# Altium schematic sheet LionIRVT-PMP40182.Control.SchDoc (part 1 of 3)
size A2; Date: Not shown in title block; ApprovedBy: Not shown in title block; CheckedBy: Not shown in title block; Author: Not shown in title block; CompanyName: Not shown in title block; Engineer: Not shown in title block; Organization: Not shown in title block; Address1: Not shown in title block; Address2: Not shown in title block; Address3: Not shown in title block; Address4: Not shown in title block; DocumentNumber: 1; Revision: Use project parameter SCH_Rev; SheetNumber: 3; SheetTotal: 3; PageSetup: Record=PageOptions|CenterHorizontal=True|CenterVertical=True|PrintScale=0.94|XCorrection=1.00|YCorrection=1.00|PrintKind=0|BorderSize=5000000|LeftOffset=0|BottomOffset=0|Orientation=2|PaperLength=1000|PaperWidth=1000|Scale=100|PaperSource=15|PrintQuality=600|MediaType=1|DitherType=10|PrintScaleMode=1|PaperKind=Letter; CurrentTime: Not shown in title block; CurrentDate: Not shown in title block; Time: Not shown in title block; DocumentFullPathAndName: Not shown in title block; DocumentName: Not shown in title block; ModifiedDate: Not shown in title block; ImagePath: Not shown in title block
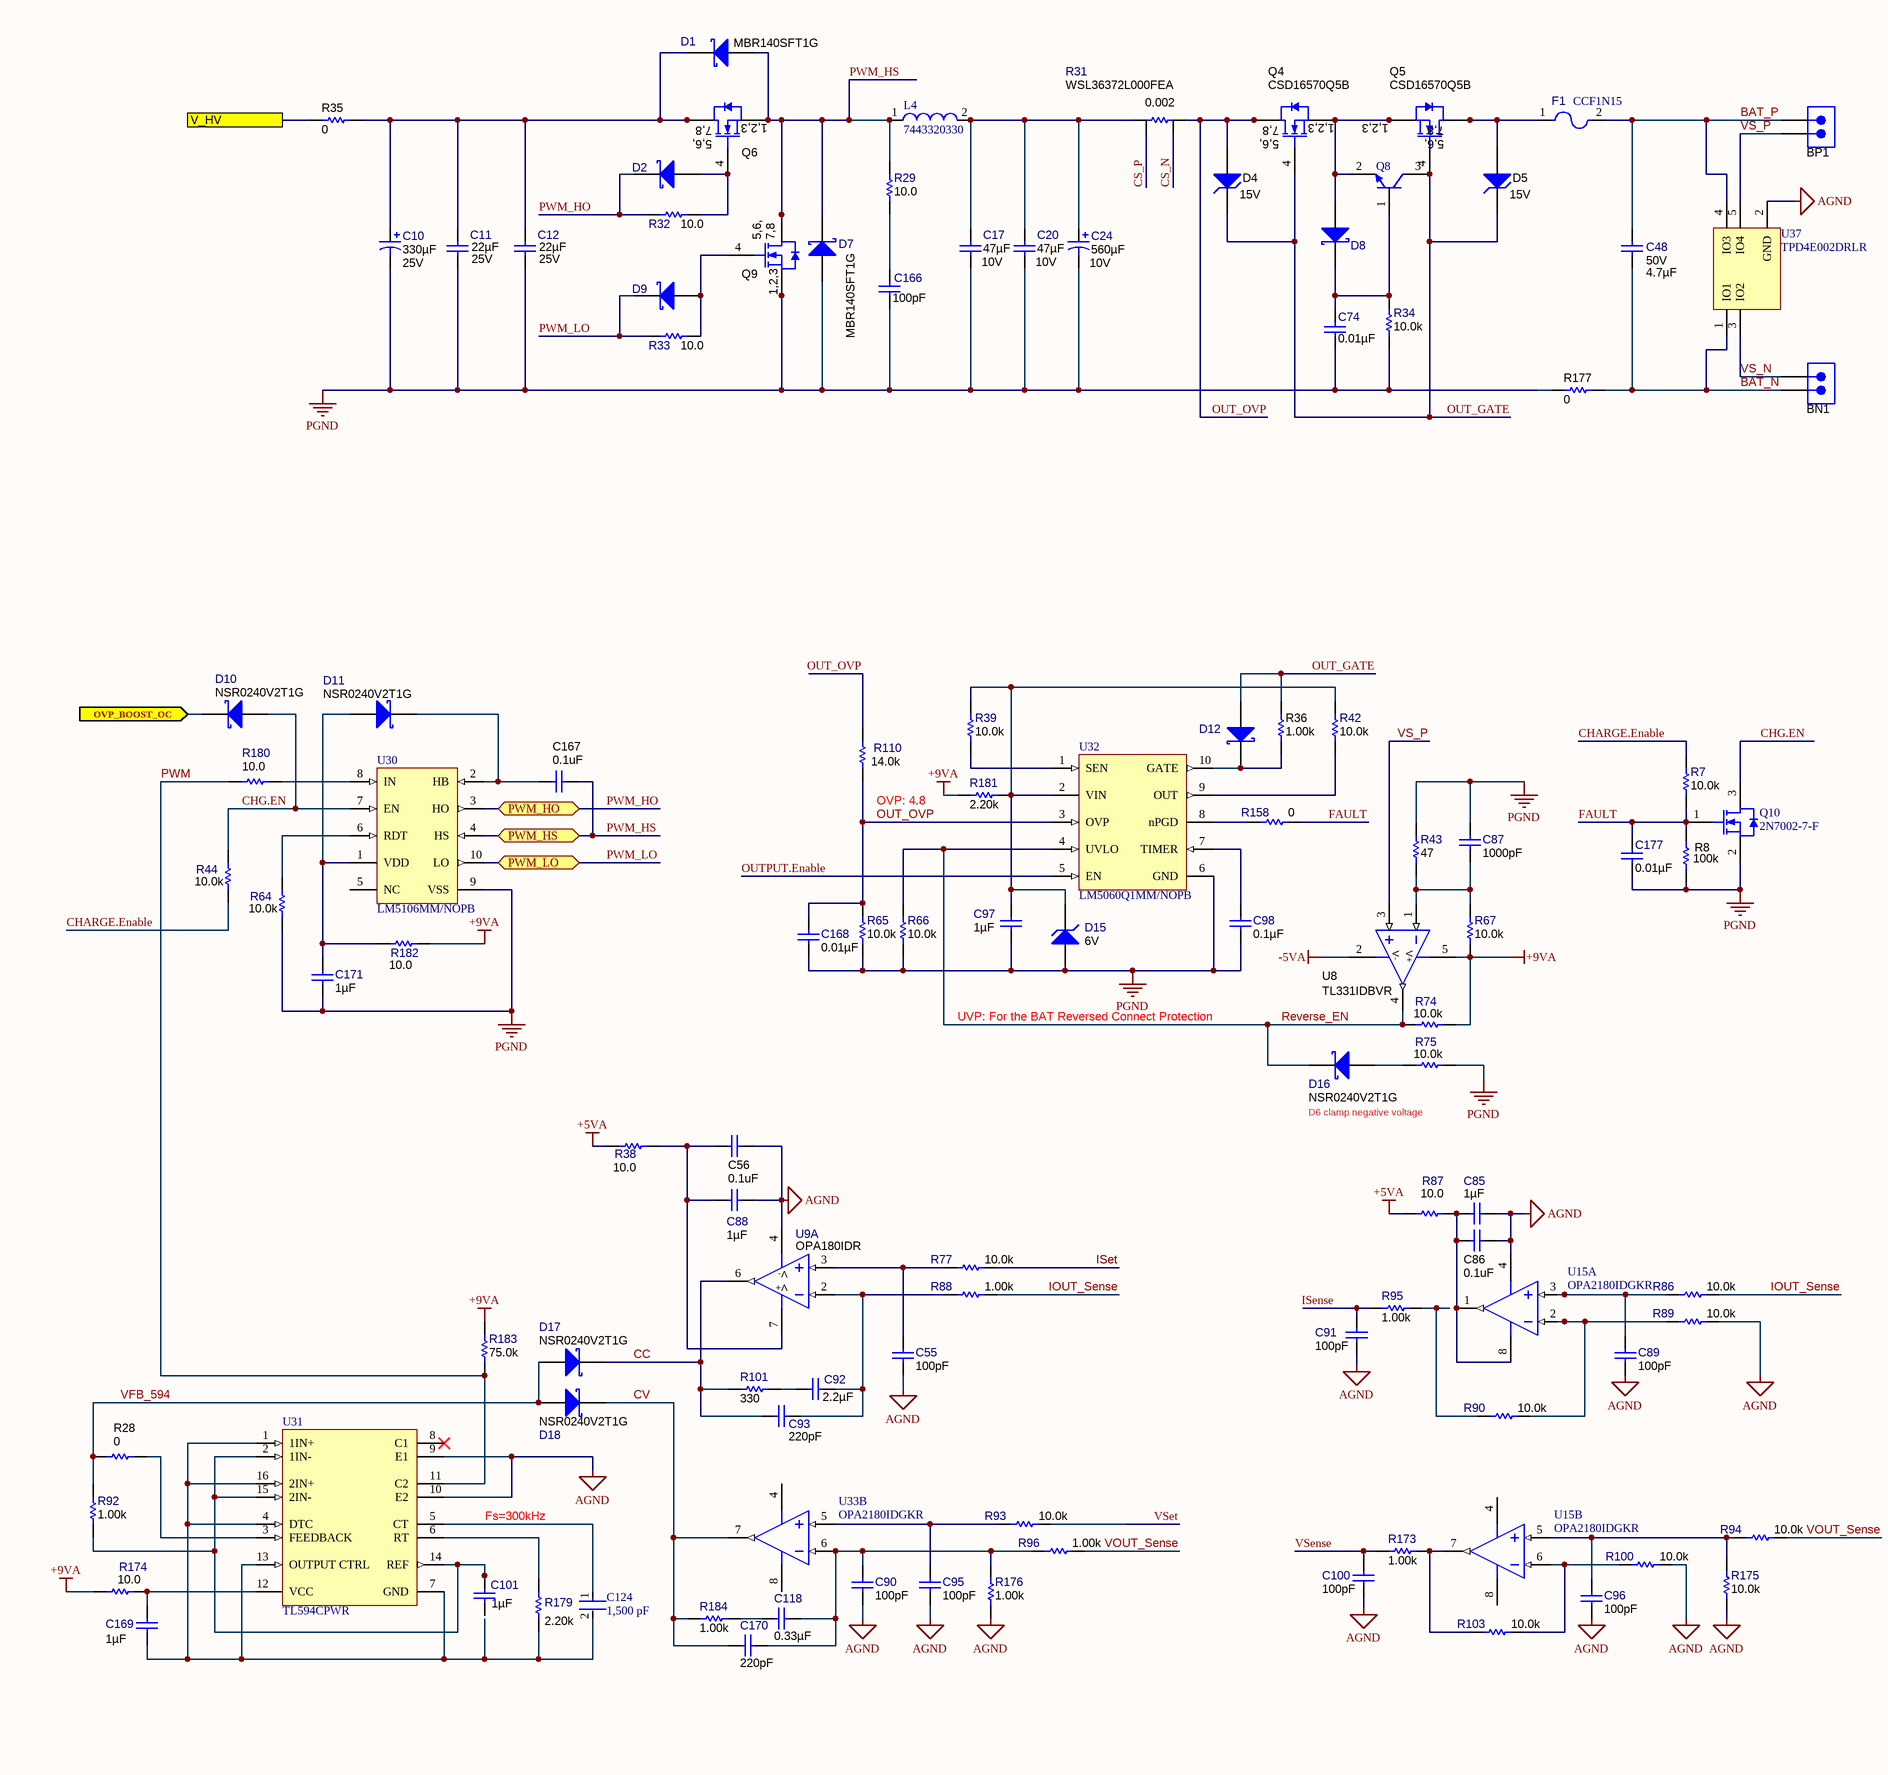
[diagram p0: LionIRVT-PMP40182.Control.SchDoc, left]
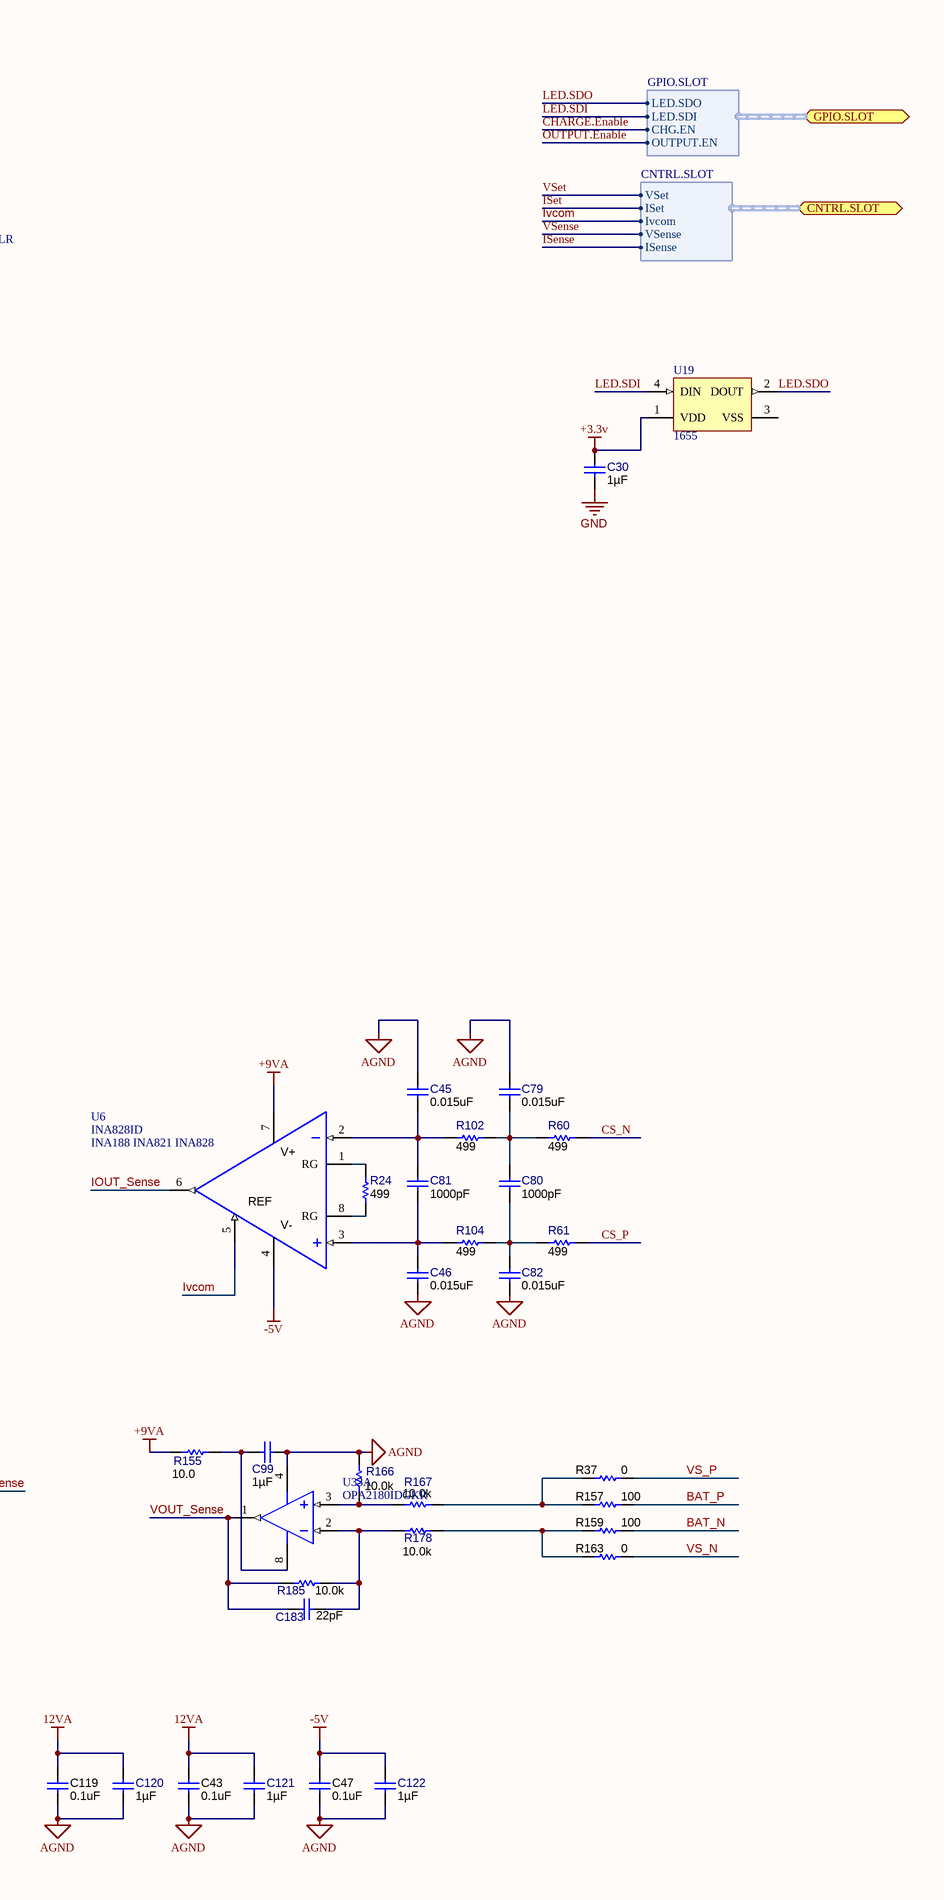
[diagram p1: LionIRVT-PMP40182.Control.SchDoc, right]

## Parts
BN1  ED555/2DS  [TERM_BLK_ED555-2DS]  (value not drawn)
BP1  ED555/2DS  [TERM_BLK_ED555-2DS]  (value not drawn)
C10  ValueDisplayed: 330µF  Value2: 25V  [CAPSMT_62_F12]  (hidden comment: 25SVPF330M)
C11  ValueDisplayed: 22µF  Value2: 25V  [1210_270]  (hidden comment: GRM32ER71E226KE15L)
C12  ValueDisplayed: 22µF  Value2: 25V  [1210_270]  (hidden comment: GRM32ER71E226KE15L)
C17  ValueDisplayed: 47µF  Value2: 10V  [1210_270]  (hidden comment: GRM32ER71A476ME15L)
C20  ValueDisplayed: 47µF  Value2: 10V  [1210_270]  (hidden comment: GRM32ER71A476ME15L)
C24  ValueDisplayed: 560µF  Value2: 10V  [SM_RADIAL_10AMM]  (hidden comment: 10SVP560M)
C30  ValueDisplayed: 1µF  [0603C]  (hidden comment: C0603C105K3RACTU)
C43  ValueDisplayed: 0.1uF  [0603C]  (hidden comment: Capacitor)
C45  ValueDisplayed: 0.015uF  [0603C]  (hidden comment: Capacitor)
C46  ValueDisplayed: 0.015uF  [0603C]  (hidden comment: Capacitor)
C47  ValueDisplayed: 0.1uF  [0603C]  (hidden comment: Capacitor)
C48  ValueDisplayed: 4.7µF  Value2: 50V  [1206L]  (hidden comment: GRM319R61H475KA12)
C55  ValueDisplayed: 100pF  [0603C]  (hidden comment: GRM1885C1H101JA01D)
C56  ValueDisplayed: 0.1uF  [0603C]  (hidden comment: Capacitor)
C74  ValueDisplayed: 0.01µF  [0603C]  (hidden comment: GRM1885C1H103JA01D)
C79  ValueDisplayed: 0.015uF  [0603C]  (hidden comment: Capacitor)
C80  ValueDisplayed: 1000pF  [0603C]  (hidden comment: Capacitor)
C81  ValueDisplayed: 1000pF  [0603C]  (hidden comment: Capacitor)
C82  ValueDisplayed: 0.015uF  [0603C]  (hidden comment: Capacitor)
C85  ValueDisplayed: 1µF  [0603C]  (hidden comment: C0603C105K3RACTU)
C86  ValueDisplayed: 0.1uF  [0603C]  (hidden comment: Capacitor)
C87  ValueDisplayed: 1000pF  [0603C]  (hidden comment: GRM1885C1H102JA01D)
C88  ValueDisplayed: 1µF  [0603C]  (hidden comment: C0603C105K3RACTU)
C89  ValueDisplayed: 100pF  [0603C]  (hidden comment: GRM1885C1H101JA01D)
C90  ValueDisplayed: 100pF  [0603C]  (hidden comment: GRM1885C1H101JA01D)
C91  ValueDisplayed: 100pF  [0603C]  (hidden comment: GRM1885C1H101JA01D)
C92  ValueDisplayed: 2.2µF  [0603C]  (hidden comment: GRM188R71A225KE15D)
C93  ValueDisplayed: 220pF  [0603C]  (hidden comment: GRM1885C1H221JA01D)
C95  ValueDisplayed: 100pF  [0603C]  (hidden comment: GRM1885C1H101JA01D)
C96  ValueDisplayed: 100pF  [0603C]  (hidden comment: GRM1885C1H101JA01D)
C97  ValueDisplayed: 1µF  [0603C]  (hidden comment: C0603C105K3RACTU)
C98  ValueDisplayed: 0.1µF  [0603C]  (hidden comment: C0603C104J3RACTU)
C99  ValueDisplayed: 1µF  [0603C]  (hidden comment: C0603C105K3RACTU)
C100  ValueDisplayed: 100pF  [0603C]  (hidden comment: GRM1885C1H101JA01D)
C101  ValueDisplayed: 1µF  [0603C]  (hidden comment: C0603C105K3RACTU)
C118  ValueDisplayed: 0.33µF  [0603C]  (hidden comment: GRM188R71A334KA61D)
C119  ValueDisplayed: 0.1uF  [0603C]  (hidden comment: Capacitor)
C120  ValueDisplayed: 1µF  [0603C]  (hidden comment: C0603C105K3RACTU)
C121  ValueDisplayed: 1µF  [0603C]  (hidden comment: C0603C105K3RACTU)
C122  ValueDisplayed: 1µF  [0603C]  (hidden comment: C0603C105K3RACTU)
C124  Capacitance: 1,500 pF  [FP-C0603C-CF-MFG]  (hidden comment: C0603C152J1GACTU)
C166  ValueDisplayed: 100pF  [0603C]  (hidden comment: GRM1885C1H101JA01D)
C167  ValueDisplayed: 0.1uF  [0603C]  (hidden comment: Capacitor)
C168  ValueDisplayed: 0.01µF  [0603C]  (hidden comment: GRM1885C1H103JA01D)
C169  ValueDisplayed: 1µF  [0603C]  (hidden comment: C0603C105K3RACTU)
C170  ValueDisplayed: 220pF  [0603C]  (hidden comment: GRM1885C1H221JA01D)
C171  ValueDisplayed: 1µF  [0603C]  (hidden comment: C0603C105K3RACTU)
C177  ValueDisplayed: 0.01µF  [0603C]  (hidden comment: GRM1885C1H103JA01D)
C183  ValueDisplayed: 22pF  [0603C]  (hidden comment: C0603C220J5GACTU)
D1  MBR140SFT1G  [SOD-123FL]
D2  NSR0240V2T1G  [SOD-523]  (value not drawn)
D4  value 15V  [sod-323]  (hidden comment: MMSZ5245BS-7-F)
D5  value 15V  [sod-323]  (hidden comment: MMSZ5245BS-7-F)
D7  MBR140SFT1G  [SOD-123FL]
D8  NSR0240V2T1G  [SOD-523]  (value not drawn)
D9  NSR0240V2T1G  [SOD-523]  (value not drawn)
D10  NSR0240V2T1G  [SOD-523]
D11  NSR0240V2T1G  [SOD-523]
D12  NSR0240V2T1G  [SOD-523]  (value not drawn)
D15  6V  [sod-323]
D16  NSR0240V2T1G  [SOD-523]
D17  NSR0240V2T1G  [SOD-523]
D18  NSR0240V2T1G  [SOD-523]
F1  CCF1N15  [FUSE_CCF]
L4  7443320330  [WE-HCC-1210]
Q4  CSD16570Q5B  [DNK8]
Q5  CSD16570Q5B  [DNK8]
Q6  CSD18502Q5B  [DNK8]  (value not drawn)
Q8  MMBT2222ALT1G  [ONSC-SOT-23-3-318-08_V]  (value not drawn)
Q9  CSD18502Q5B  [DNK8]  (value not drawn)
Q10  2N7002-7-F  [DIOD-SOT23-3_V]
R7  ValueDisplayed: 10.0k  [0603R]  (hidden comment: RC0603FR-0710KL)
R8  ValueDisplayed: 100k  [0603R]  (hidden comment: Resistor)
R24  ValueDisplayed: 499  [0603R]  (hidden comment: RC0603FR-07499RL)
R28  ValueDisplayed: 0  [0603R]  (hidden comment: Resistor)
R29  ValueDisplayed: 10.0  [1206L]  (hidden comment: RC1206FR-0710RL)
R31  WSL36372L000FEA  ValueDisplayed: 0.002  [WSL3637_0.001]
R32  ValueDisplayed: 10.0  [0603R]  (hidden comment: RC0603FR-0710RL)
R33  ValueDisplayed: 10.0  [0603R]  (hidden comment: RC0603FR-0710RL)
R34  ValueDisplayed: 10.0k  [0603R]  (hidden comment: RC0603FR-0710KL)
R35  value 0  [1206]  (hidden comment: ERJ-8ENF10R0V)
R36  ValueDisplayed: 1.00k  [0603R]  (hidden comment: Resistor)
R37  ValueDisplayed: 0  [0603R]  (hidden comment: Resistor)
R38  ValueDisplayed: 10.0  [0603R]  (hidden comment: RC0603FR-0710RL)
R39  ValueDisplayed: 10.0k  [0603R]  (hidden comment: RC0603FR-0710KL)
R42  ValueDisplayed: 10.0k  [0603R]  (hidden comment: RC0603FR-0710KL)
R43  ValueDisplayed: 47  [0603R]  (hidden comment: CRCW060347R0JNEA)
R44  ValueDisplayed: 10.0k  [0603R]  (hidden comment: RC0603FR-0710KL)
R60  ValueDisplayed: 499  [0603R]  (hidden comment: Resistor)
R61  ValueDisplayed: 499  [0603R]  (hidden comment: Resistor)
R64  ValueDisplayed: 10.0k  [0603R]  (hidden comment: RC0603FR-0710KL)
R65  ValueDisplayed: 10.0k  [0603R]  (hidden comment: RC0603FR-0710KL)
R66  ValueDisplayed: 10.0k  [0603R]  (hidden comment: RC0603FR-0710KL)
R67  ValueDisplayed: 10.0k  [0603R]  (hidden comment: RC0603FR-0710KL)
R74  ValueDisplayed: 10.0k  [0603R]  (hidden comment: RC0603FR-0710KL)
R75  ValueDisplayed: 10.0k  [0603R]  (hidden comment: RC0603FR-0710KL)
R77  ValueDisplayed: 10.0k  [0603R]  (hidden comment: RC0603FR-0710KL)
R86  ValueDisplayed: 10.0k  [0603R]  (hidden comment: RC0603FR-0710KL)
R87  ValueDisplayed: 10.0  [0603R]  (hidden comment: RC0603FR-0710RL)
R88  ValueDisplayed: 1.00k  [0603R]  (hidden comment: RC0603FR-071KL)
R89  ValueDisplayed: 10.0k  [0603R]  (hidden comment: RC0603FR-0710KL)
R90  ValueDisplayed: 10.0k  [0603R]  (hidden comment: RC0603FR-0710KL)
R92  ValueDisplayed: 1.00k  [0603R]  (hidden comment: RC0603FR-071KL)
R93  ValueDisplayed: 10.0k  [0603R]  (hidden comment: RC0603FR-0710KL)
R94  ValueDisplayed: 10.0k  [0603R]  (hidden comment: RC0603FR-0710KL)
R95  ValueDisplayed: 1.00k  [0603R]  (hidden comment: RC0603FR-071KL)
R96  ValueDisplayed: 1.00k  [0603R]  (hidden comment: RC0603FR-071KL)
R100  ValueDisplayed: 10.0k  [0603R]  (hidden comment: RC0603FR-0710KL)
R101  ValueDisplayed: 330  [0603R]  (hidden comment: RC0603FR-07330RL)
R102  ValueDisplayed: 499  [0603R]  (hidden comment: CRCW0603499RFKEA)
R103  ValueDisplayed: 10.0k  [0603R]  (hidden comment: RC0603FR-0710KL)
R104  ValueDisplayed: 499  [0603R]  (hidden comment: CRCW0603499RFKEA)
R110  ValueDisplayed: 14.0k  [0603R]  (hidden comment: RC0603FR-0714KL)
R155  ValueDisplayed: 10.0  [0603R]  (hidden comment: RC0603FR-0710RL)
R157  ValueDisplayed: 100  [0603R]  (hidden comment: Resistor)
R158  ValueDisplayed: 0  [0603R]  (hidden comment: RC0603JR-070RL)
R159  ValueDisplayed: 100  [0603R]  (hidden comment: Resistor)
R163  ValueDisplayed: 0  [0603R]  (hidden comment: Resistor)
R166  ValueDisplayed: 10.0k  [0603R]  (hidden comment: RC0603FR-0710KL)
R167  ValueDisplayed: 10.0k  [0603R]  (hidden comment: RC0603FR-0710KL)
R173  ValueDisplayed: 1.00k  [0603R]  (hidden comment: RC0603FR-071KL)
R174  ValueDisplayed: 10.0  [0603R]  (hidden comment: RC0603FR-0710RL)
R175  ValueDisplayed: 10.0k  [0603R]  (hidden comment: RC0603FR-0710KL)
R176  ValueDisplayed: 1.00k  [0603R]  (hidden comment: RC0603FR-071KL)
R177  value 0  [1206]  (hidden comment: ERJ-8ENF10R0V)
R178  ValueDisplayed: 10.0k  [0603R]  (hidden comment: RC0603FR-0710KL)
R179  ValueDisplayed: 2.20k  [0603R]  (hidden comment: RC0603FR-072K2L)
R180  ValueDisplayed: 10.0  [0603R]  (hidden comment: RC0603FR-0710RL)
R181  ValueDisplayed: 2.20k  [0603R]  (hidden comment: RC0603FR-072K2L)
R182  ValueDisplayed: 10.0  [0603R]  (hidden comment: RC0603FR-0710RL)
R183  ValueDisplayed: 75.0k  [0603R]  (hidden comment: RC0603FR-0775KL)
R184  ValueDisplayed: 1.00k  [0603R]  (hidden comment: RC0603FR-071KL)
R185  ValueDisplayed: 10.0k  [0603R]  (hidden comment: RC0603FR-0710KL)
U6  INA828ID  [D0008A_N]
U8  TL331IDBVR  [DBV0005A_N]
U9  OPA180IDR  [D0008A_N]  (part A of 2)
U15  OPA2180IDGKR  [DGK0008A_N]  (parts A,B of 2)
U19  1655  [ADA-RGB-1655_V]
U30  LM5106MM/NOPB  [DGS0010A_N]
U31  TL594CPWR  [PW0016A_M]
U32  LM5060Q1MM/NOPB  [DGS0010A_N]
U33  OPA2180IDGKR  [DGK0008A_N]  (parts A,B of 2)
U37  TPD4E002DRLR  [DRL0005A_L]

## Ports
CNTRL.SLOT (bidir, harness CNTRL.SLOT), GPIO.SLOT (bidir, harness GPIO.SLOT), OVP_BOOST_OC (in), PWM_HO (bidir), PWM_HS (bidir), PWM_LO (bidir), V_HV

## Harnesses
GPIO.SLOT: LED.SDO, CHG.EN, LED.SDI, OUTPUT.EN
CNTRL.SLOT: VSet, ISet, Ivcom, VSense, ISense

## Nets
12VA: C43.1 C119.1 C120.2 C121.2
+3.3v: C30.2 U19.1(VDD)
+5VA: R38.2 R87.2
+9VA: R67.2 R74.1 R155.1 R174.1 R181.1 R182.2 R183.2 U6.7(V+) U8.5(V+)
-5V: C47.1 C122.2 U6.4(V-)
-5VA: U8.2(V-/GND)
AGND: C43.2 C45.2 C46.2 C47.2 C55.1 C56.2 C79.2 C82.2 C85.1 C86.2 C88.1 C89.1 C90.1 C91.2 C95.1 C96.1 C99.2 C100.2 C119.2 C120.1 C121.1 C122.1 R89.1 R100.1 R166.2 R175.2 R176.2 U9.4(V-) U15.4(V-) U31.9(E1) U31.10(E2) U33.4(V-) U37.2(GND)
GND: C30.1
PGND: C10.2(-) C11.2 C12.2 C17.2 C20.2 C24.2(-) C74.2 C87.1 C97.2 C98.1 C166.1 C168.1 C171.2 C177.1 D7.2(A) D15.2(A) Q9.1(S) Q9.2(S) Q9.3(S) Q10.2(S) R8.1 R34.2 R43.1 R64.1 R65.2 R66.2 R75.1 R177.1 U30.9(VSS) U32.6(GND)
BAT_N: BN1.2 C48.2 R159.2 R177.2 U37.1(IO1)
BAT_P: BP1.1 C48.1 F1.2 R157.2 U37.4(IO3)
CC: C93.1 D17.1(K) R101.2 U9.6(OUT)
CHARGE.Enable: R7.1 R44.1 ; port GPIO.SLOT.CHG.EN
CHG.EN: D10.2(A) Q10.3(D) R44.2 U30.7(EN)
CS_N: R31.3 R60.1
CS_P: R31.4 R61.1
CV: C170.1 D18.1(K) R184.2 U33.7(OUT_B)
FAULT: C177.2 Q10.1(G) R7.2 R8.2 R158.1
IOUT_Sense: R86.1 R88.1 U6.6(OUT)
ISense: port CNTRL.SLOT.ISense
ISet: R77.1 ; port CNTRL.SLOT.ISet
Ivcom: U6.5(REF) ; port CNTRL.SLOT.Ivcom
LED.SDI: U19.4(DIN) ; port GPIO.SLOT.LED.SDI
LED.SDO: U19.2(DOUT) ; port GPIO.SLOT.LED.SDO
OUT_GATE: D4.1(K) D5.1(K) D12.2(A) Q4.4(G) Q5.4(G) Q8.3(C) R36.2
OUT_OVP: C168.2 D4.2(A) Q4.5(D) Q4.6(D) Q4.7(D) Q4.8(D) R31.1 R65.1 R110.1 R110.2 U32.3(OVP)
OUTPUT.Enable: U32.5(EN) ; port GPIO.SLOT.OUTPUT.EN
OVP_BOOST_OC: D10.1(K) ; port OVP_BOOST_OC
PWM: R180.1 R183.1 U31.11(C2)
PWM_HO: D2.1(K) R32.2 U30.3(HO) ; port PWM_HO
PWM_HS: C167.2 D1.2(A) D7.1(K) L4.1 Q6.1(S) Q6.2(S) Q6.3(S) Q9.5(D) Q9.6(D) Q9.7(D) Q9.8(D) R29.1 U30.4(HS) ; port PWM_HS
PWM_LO: D9.1(K) R33.2 U30.10(LO) ; port PWM_LO
Reverse_EN: D16.1(K) R66.1 R74.2 U8.4(OUT) U32.4(UVLO)
V_HV: R35.1 ; port V_HV
VFB_594: D17.2(A) D18.2(A) R28.1 R92.2
VOUT_Sense: C183.1 R94.1 R96.1 R185.2 U33.1(OUT_A)
VS_N: BN1.1 R163.2 U37.3(IO2)
VS_P: BP1.2 R37.2 U8.3(IN+) U37.5(IO4)
VSense: C100.1 R173.2 ; port CNTRL.SLOT.VSense
VSet: R93.1 ; port CNTRL.SLOT.VSet
NetC10_1: C10.1(+) C11.1 C12.1 D1.1(K) Q6.5(D) Q6.6(D) Q6.7(D) Q6.8(D) R35.2
NetC17_1: C17.1 C20.1 C24.1(+) L4.2 R31.2
NetC45_1: C45.1 C81.1 R102.2 U6.2(IN-)
NetC46_1: C46.1 C81.2 R104.2 U6.3(IN+)
NetC55_2: C55.2 R77.2 U9.3(IN+)
NetC56_1: C56.1 C88.2 R38.1 U9.7(V+)
NetC74_1: C74.1 D8.1(K) Q8.1(B) R34.1
NetC79_1: C79.1 C80.1 R60.2 R102.1
NetC80_2: C80.2 C82.1 R61.2 R104.1
NetC85_2: C85.2 C86.1 R87.1 U15.1(OUT_A) U15.8(V+)
NetC87_2: C87.2 R43.2 R67.1 U8.1(IN-)
NetC89_2: C89.2 R86.2 U15.3(IN_A+)
NetC90_2: C90.2 C118.2 C170.2 R96.2 R176.1 U33.6(IN_B-)
NetC91_1: C91.1 R95.2
NetC92_1: C92.1 R101.1
NetC92_2: C92.2 C93.2 R88.2 U9.2(IN-)
NetC95_2: C95.2 R93.2 U33.5(IN_B+)
NetC96_2: C96.2 R94.2 R175.1 U15.5(IN_B+)
NetC97_1: C97.1 D15.1(K) R39.2 R42.1 R181.2 U32.2(VIN)
NetC98_2: C98.2 U32.7(TIMER)
NetC99_1: C99.1 R155.2 U33.8(V+)
NetC101_1: C101.1 R92.1 U31.2(1IN-) U31.14(REF) U31.15(2IN-)
NetC118_1: C118.1 R184.1
NetC124_1: C124.1 U31.5(CT)
NetC124_2: C124.2 C169.2 R179.1 U31.1(1IN+) U31.4(DTC) U31.7(GND) U31.13(OUTPUT_CTRL) U31.16(2IN+)
NetC166_2: C166.2 R29.2
NetC167_1: C167.1 D11.1(K) U30.2(HB)
NetC169_1: C169.1 R174.2 U31.12(VCC)
NetC171_1: C171.1 D11.2(A) R182.1 U30.1(VDD)
NetC183_2: C183.2 R178.2 R185.1 U33.2(IN_A-)
NetD2_2: D2.2(A) Q6.4(G) R32.1
NetD5_2: D5.2(A) F1.1 Q5.5(D) Q5.6(D) Q5.7(D) Q5.8(D)
NetD8_2: D8.2(A) Q4.1(S) Q4.2(S) Q4.3(S) Q5.1(S) Q5.2(S) Q5.3(S) Q8.2(E)
NetD9_2: D9.2(A) Q9.4(G) R33.1
NetD12_1: D12.1(K) R36.1 U32.10(GATE)
NetD16_2: D16.2(A) R75.2
NetR24_1: R24.1 U6.1(RG)
NetR24_2: R24.2 U6.8(RG)
NetR28_2: R28.2 U31.3(FEEDBACK)
NetR37_1: R37.1 R157.1 R167.1
NetR39_1: R39.1 U32.1(SEN)
NetR42_2: R42.2 U32.9(OUT)
NetR64_2: R64.2 U30.6(RDT)
NetR89_2: R89.2 R90.1 U15.2(IN_A-)
NetR90_2: R90.2 R95.1
NetR100_2: R100.2 R103.1 U15.6(IN_B-)
NetR103_2: R103.2 R173.1 U15.7(OUT_B)
NetR158_2: R158.2 U32.8(nPGD)
NetR159_1: R159.1 R163.1 R178.1
NetR166_1: R166.1 R167.2 U33.3(IN_A+)
NetR179_2: R179.2 U31.6(RT)
NetR180_2: R180.2 U30.8(IN)

Not connected (* = marked no-connect by the designer): C101 2; U19 3(VSS); U30 5(NC); U31 8(C1)*

## Notes on the sheet
- OVP: 4.8
- UVP: For the BAT Reversed Connect Protection
- D6 clamp negative voltage
- (near U6) INA188 INA821 INA828
- Fs=300kHz
- Labels drawn without touching a wire or pin: ISense
- Title
- Size:
- Date:
- File:
- A2
- Number:
- Time:
- Revision:
- Sheet
- of
- (in symbol CSD16570Q5B) 7,8; 1,2,3; 5,6,
- (in symbol CSD18502Q5B) 5,6,; 7,8; 1,2,3
- (in symbol TL331IDBVR) V-